# Altium schematic sheet PARK_COUNTER_PT1_2.SchDoc: UFABC PARK COUNTER
size A4; DrawnBy: Muriel Costa; Organization: UFABC - UNIVERSIDADE; Address1: Av. dos Estados, 5001; Muriel Costa: (11) 94869-993; Responsável: Muriel Costa; Revision: PT1; SheetNumber: 2; SheetTotal: 2; Obs: Feito com muito amor e carinho para a nossa universidade de ponta do século 21; Address2: SP-Brasil; Address: NSW; Contato: mrlcosta0@gmail.com
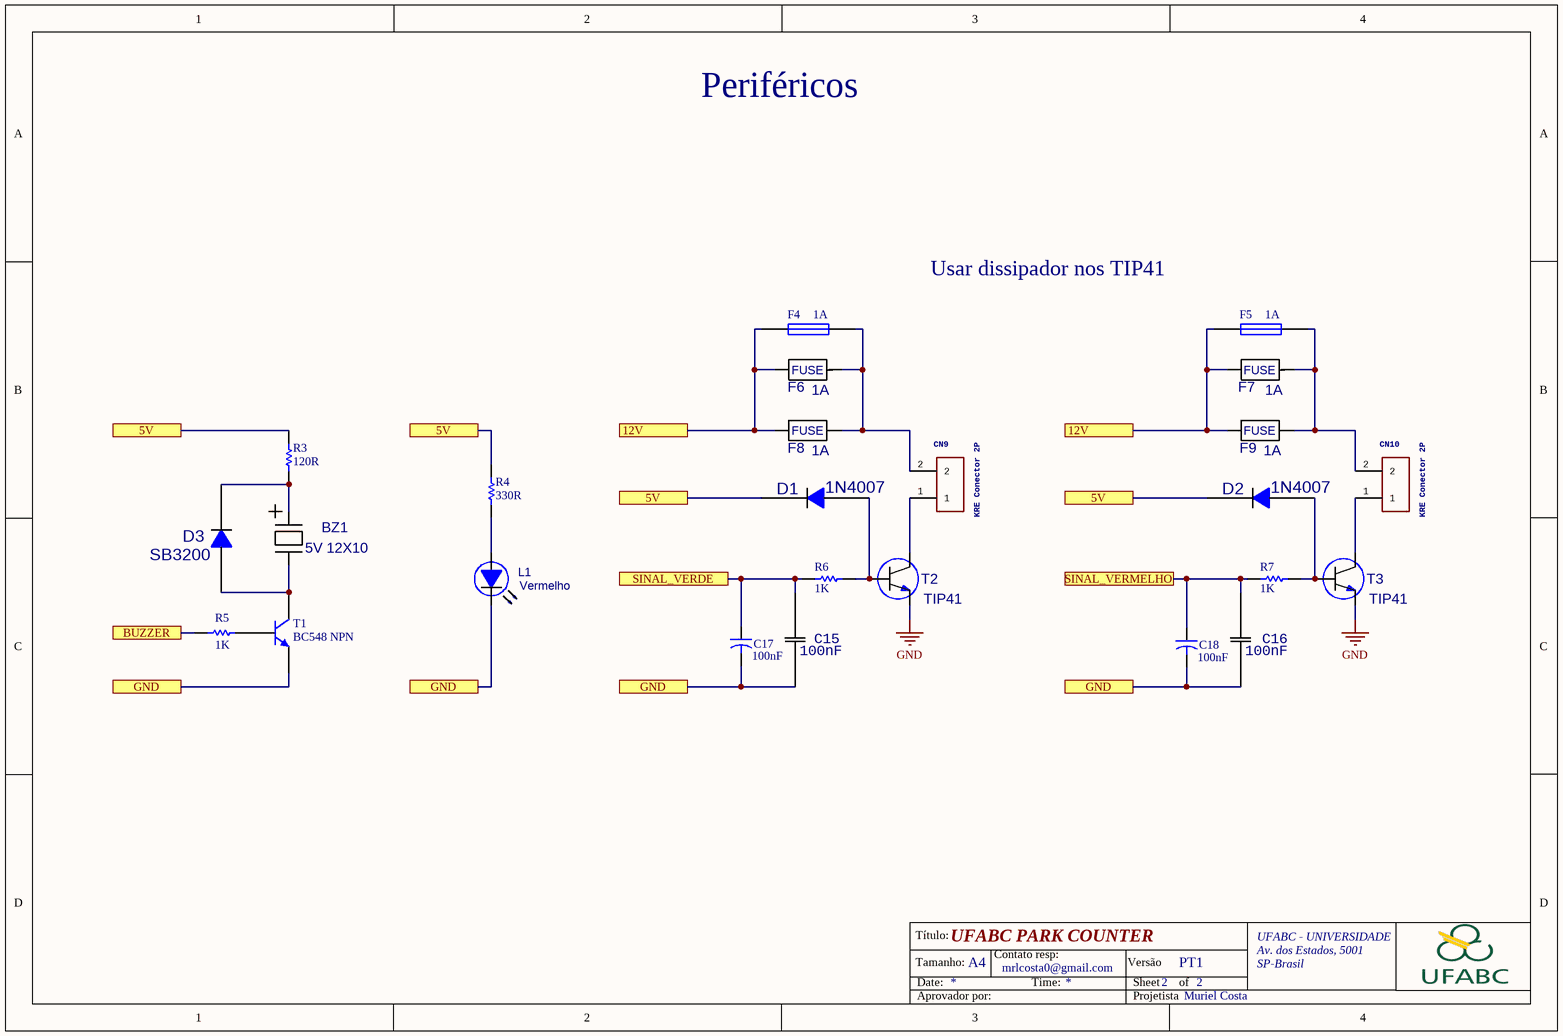
[diagram p0: PARK_COUNTER_PT1_2.SchDoc]

## Parts
BZ1  5V 12X10  [BUZZER 12mm]
C15  value 100nF  [C0603]  (hidden comment: C0603)
C16  value 100nF  [C0603]  (hidden comment: C0603)
C17  value 100nF  [CAPR5-4X5]  (hidden comment: Cap2)
C18  value 100nF  [CAPR5-4X5]  (hidden comment: Cap2)
CN9  KRE Conector 2P  [KRE-2P]
CN10  KRE Conector 2P  [KRE-2P]
D1  value 1N4007  [DO-35_1]  (hidden comment: 1N400X)
D2  value 1N4007  [DO-35_1]  (hidden comment: 1N400X)
D3  value SB3200  [DO-35_1]  (hidden comment: 1N400X)
F4  1A  [PIN-W2/E2.8]
F5  1A  [PIN-W2/E2.8]
F6  value 1A  [MINI_FUSE_BOARD_GLASS]  (hidden comment: MINI_FUSE_BOARD_GLASS)
F7  value 1A  [MINI_FUSE_BOARD_GLASS]  (hidden comment: MINI_FUSE_BOARD_GLASS)
F8  value 1A  [fuse_board_suporte]  (hidden comment: MINI_FUSE_BOARD_SUP_GLASS)
F9  value 1A  [fuse_board_suporte]  (hidden comment: MINI_FUSE_BOARD_SUP_GLASS)
L1  value Vermelho  [LED5MM_180G]  (hidden comment: LED5MM_180G)
R3  value 120R  [AXIAL-0.3]  (hidden comment: Res1)
R4  value 330R  [AXIAL-0.3]  (hidden comment: Res1)
R5  value 1K  [AXIAL-0.3]  (hidden comment: Res1)
R6  value 1K  [AXIAL-0.3]  (hidden comment: Res1)
R7  value 1K  [AXIAL-0.3]  (hidden comment: Res1)
T1  BC548 NPN  [TO-226-AA]
T2  value TIP41  [TO-220]  (hidden comment: TIP 41)
T3  value TIP41  [TO-220]  (hidden comment: TIP 41)

## Ports
5V, 12V, BUZZER, GND, SINAL_VERDE, SINAL_VERMELHO

## Nets
GND: T2.3(Emitter) T3.3(Emitter)
5V: D1.1(K) D2.1(K) R3.2 R4.1 ; port 5V
12V: F4.1 F5.1 F6.2 F7.2 F8.2 F9.2 ; port 12V
BUZZER: R5.1 ; port BUZZER
GND: C15.1 C16.1 C17.2 C18.2 L1.2(K) T1.3(E) ; port GND  [a separate net that carries the same name]
SINAL_VERDE: C15.2 C17.1 R6.1 ; port SINAL_VERDE
SINAL_VERMELHO: C16.2 C18.1 R7.1 ; port SINAL_VERMELHO
NetBZ1_1: BZ1.1 D3.1(K) R3.1
NetBZ1_2: BZ1.2 D3.2(A) T1.1(C)
NetCN9_1: CN9.1 T2.2(Collector)
NetCN9_2: CN9.2 F4.2 F6.1 F8.1
NetCN10_1: CN10.1 T3.2(Collector)
NetCN10_2: CN10.2 F5.2 F7.1 F9.1
NetD1_2: D1.2(A) R6.2 T2.1(Base)
NetD2_2: D2.2(A) R7.2 T3.1(Base)
NetL1_1: L1.1(A) R4.2
NetR5_2: R5.2 T1.2(B)

Not connected (* = marked no-connect by the designer): F6 3 4; F7 3 4; F8 3 4; F9 3 4

## Notes on the sheet
- Periféricos
- Usar dissipador nos TIP41
- Título:
- Tamanho:
- Date:
- A4
- Contato resp:
- mrlcosta0@gmail.com
- Time:
- Versão
- Sheet
- of
- Aprovador por:
- Projetista
- (in symbol fuse_board_glass) FUSE
- (in symbol fuse_board_suporte) FUSE

## Library data of the parts
BZ1 = BZ_MINI_6V_S/OSC_D12_A10_P7,5: BUZZER d12mm h10mm p7,5mm; Part Number: 009.01.00011; Value: 5V 12X10
C15 C16 = C0603: Capacitor
C17 C18 = Cap2: Capacitor; Published: 23-Sep-2002; PackageReference: CAPR5-4X5; Publisher: Altium Limited; PackageDescription: Capacitor; 2 Leads
CN9 CN10 = KRE-2P: GateName_1: G$1; SymbolName_1: KRE-2P; LibraryName: kre; DeviceSetName: KRE-2P; Package: KRE-2P
D1-D3 = 1N400X: Diode
F4 F5 = Fuse 1: Fuse; Published: 8-Jun-2000; LatestRevisionDate: 17-Jul-2002; LatestRevisionNote: Re-released for DXP Platform.; PackageReference: PIN-W2/E2.8; Publisher: Altium Limited; PackageDescription: Thru-Hole; 2 Leads
F6 F7 = fuse_board_glass
F8 F9 = fuse_board_suporte
L1 = LED5MM_180G: Light Emitting Diode
R3-R7 = Res1: Resistor; Published: 8-Jun-2000; LatestRevisionDate: 17-Jul-2002; LatestRevisionNote: Re-released for DXP Platform.; PackageReference: AXIAL-0.3; Publisher: Altium Limited; PackageDescription: Axial Device, Thru-Hole; 2 Leads; 0.3 in Pin Spacing
T1 = NPN: NPN Bipolar Transistor; Published: 8-Jun-2000; LatestRevisionDate: 17-Jul-2002; LatestRevisionNote: Re-released for DXP Platform.; PackageReference: TO-226-AA; Publisher: Altium Limited; PackageDescription: TO, Flat Index; 3 In-Line, Axial Leads; Body Dia. 4.8mm; Leads 0.55 x 0.51 mm (max); Code_JEDEC: TO-226-AA
T2 T3 = T_TIP41: NPN Transistor